# Altium schematic sheet schematic_sn74hc595n.SchDoc
size A3
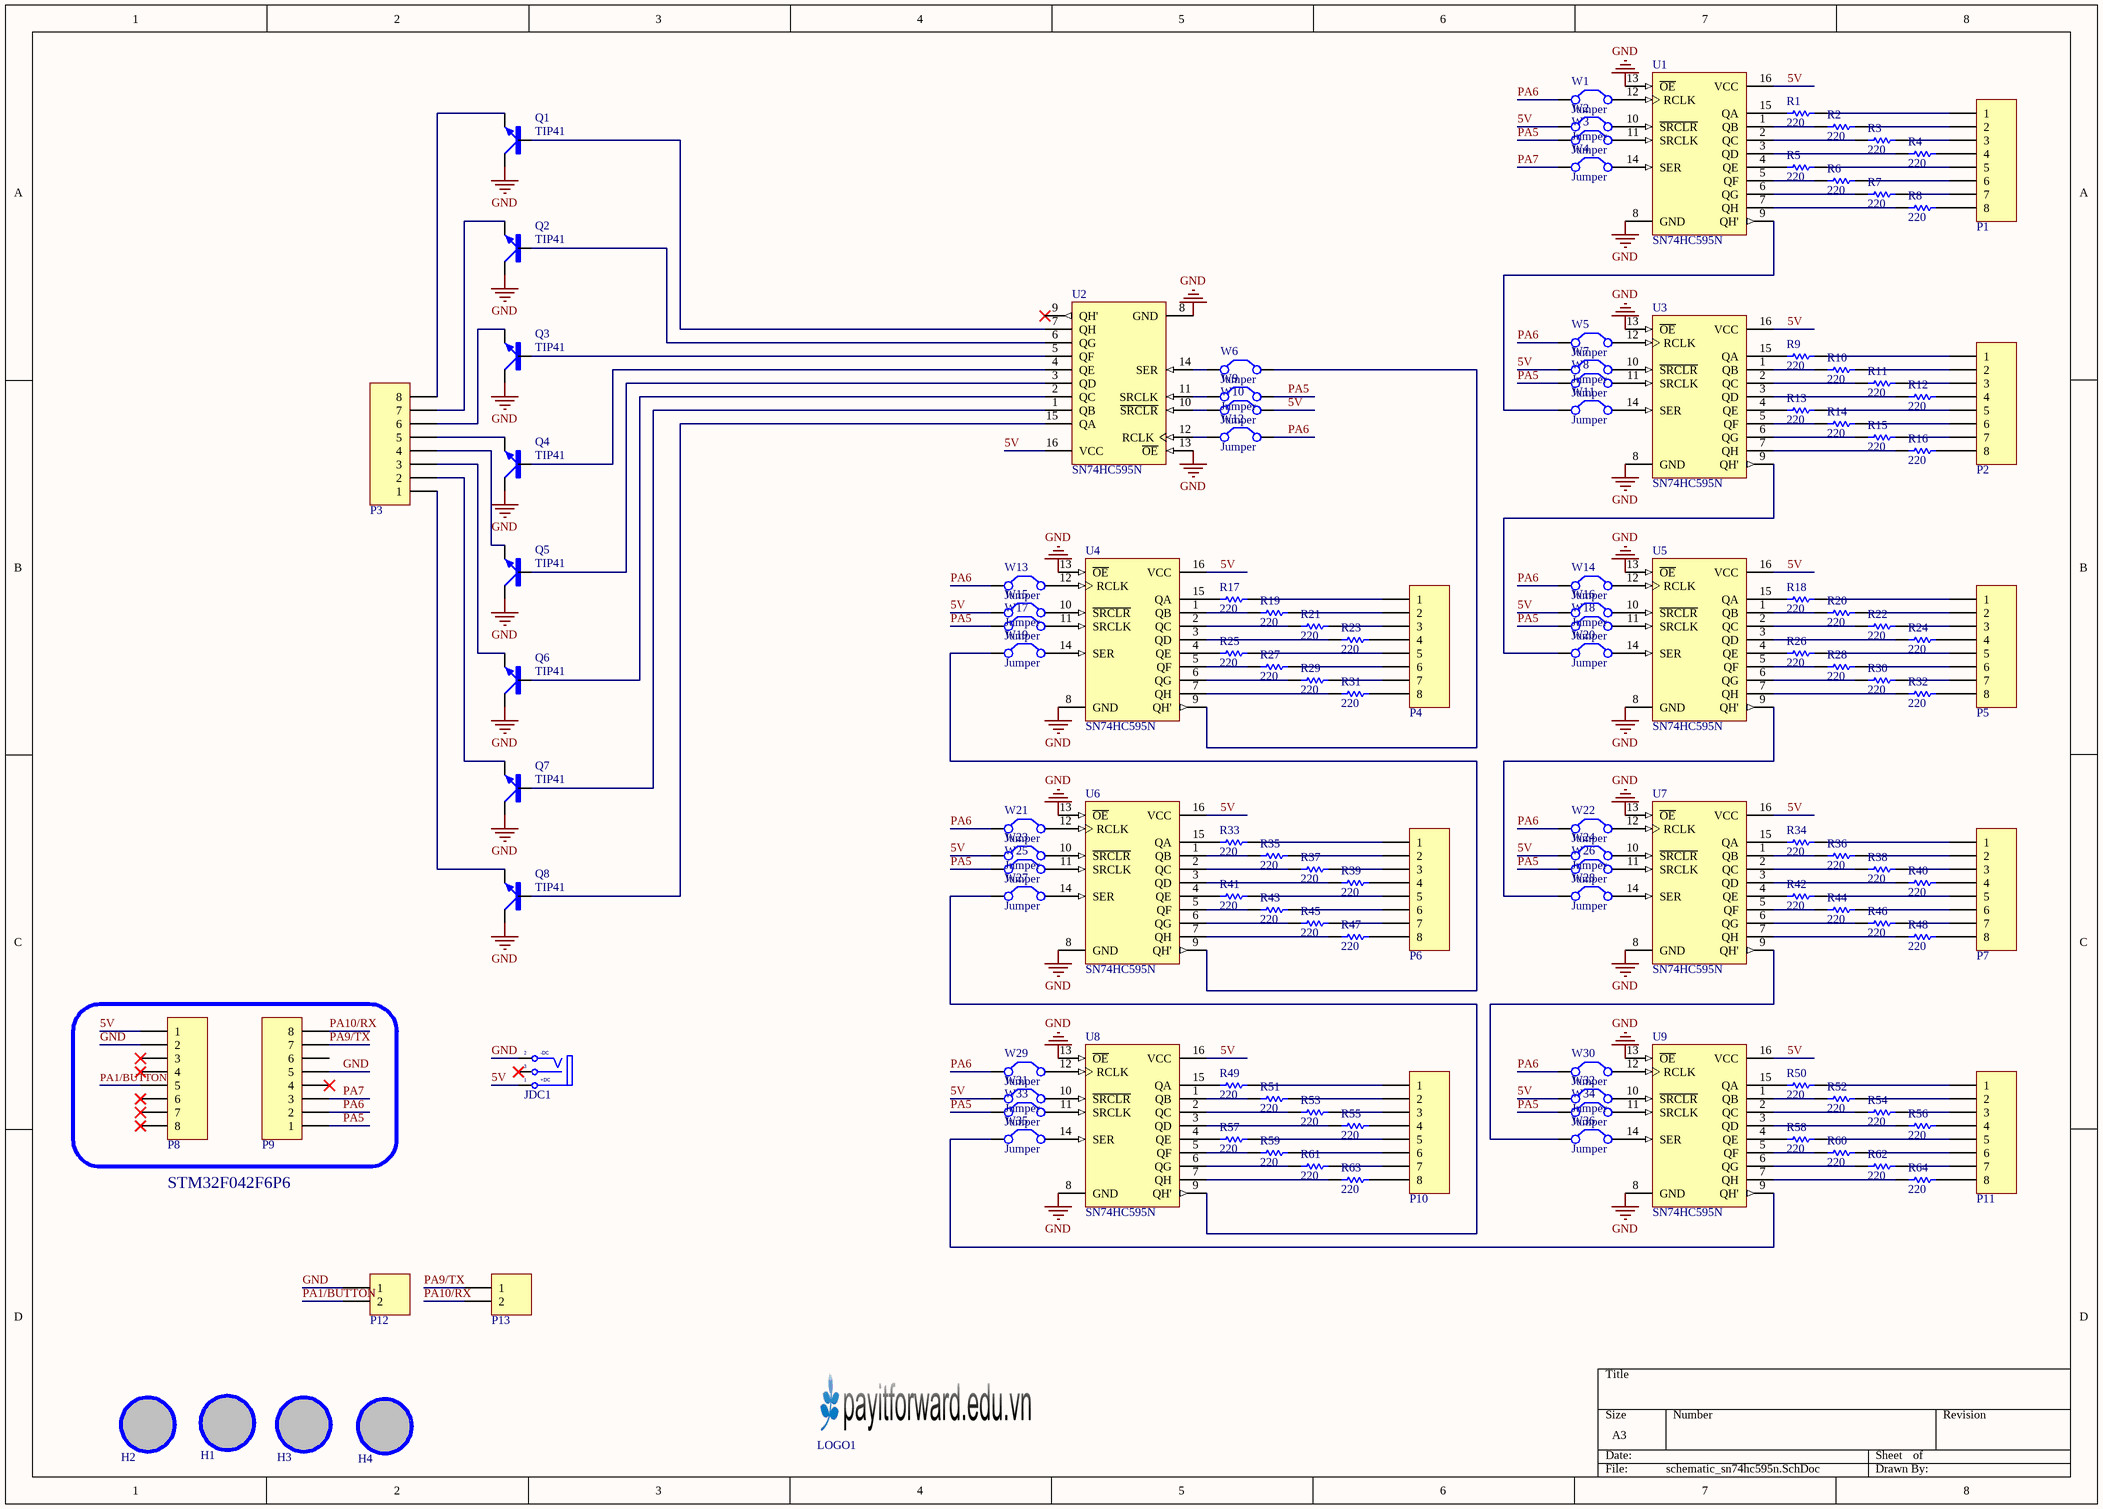
[diagram p0: schematic_sn74hc595n.SchDoc]

## Parts
H1  Hole  [LO KHOAN 3MM]  (value not drawn)
H2  Hole  [LO KHOAN 3MM]  (value not drawn)
H3  Hole  [LO KHOAN 3MM]  (value not drawn)
H4  Hole  [LO KHOAN 3MM]  (value not drawn)
JDC1  Jack DC  [DC-IN]  (value not drawn)
LOGO1  LOGO PIF  [PIF LOGO BIG SSTOP]  (value not drawn)
P1  Header 8  [JP8]  (value not drawn)
P2  Header 8  [JP8]  (value not drawn)
P3  Header 8  [JP8]  (value not drawn)
P4  Header 8  [JP8]  (value not drawn)
P5  Header 8  [JP8]  (value not drawn)
P6  Header 8  [JP8]  (value not drawn)
P7  Header 8  [JP8]  (value not drawn)
P8  Header 8  [JP8]  (value not drawn)
P9  Header 8  [JP8]  (value not drawn)
P10  Header 8  [JP8]  (value not drawn)
P11  Header 8  [JP8]  (value not drawn)
P12  Header 2  [JP2]  (value not drawn)
P13  Header 2  [JP2]  (value not drawn)
Q1  TIP41  [TRANSISTOR-TO220AV-BCE]
Q2  TIP41  [TRANSISTOR-TO220AV-BCE]
Q3  TIP41  [TRANSISTOR-TO220AV-BCE]
Q4  TIP41  [TRANSISTOR-TO220AV-BCE]
Q5  TIP41  [TRANSISTOR-TO220AV-BCE]
Q6  TIP41  [TRANSISTOR-TO220AV-BCE]
Q7  TIP41  [TRANSISTOR-TO220AV-BCE]
Q8  TIP41  [TRANSISTOR-TO220AV-BCE]
R1  value 220  [RES 1/2W]  (hidden comment: RESISTOR)
R2  value 220  [RES 1/2W]  (hidden comment: RESISTOR)
R3  value 220  [RES 1/2W]  (hidden comment: RESISTOR)
R4  value 220  [RES 1/2W]  (hidden comment: RESISTOR)
R5  value 220  [RES 1/2W]  (hidden comment: RESISTOR)
R6  value 220  [RES 1/2W]  (hidden comment: RESISTOR)
R7  value 220  [RES 1/2W]  (hidden comment: RESISTOR)
R8  value 220  [RES 1/2W]  (hidden comment: RESISTOR)
R9  value 220  [RES 1/2W]  (hidden comment: RESISTOR)
R10  value 220  [RES 1/2W]  (hidden comment: RESISTOR)
R11  value 220  [RES 1/2W]  (hidden comment: RESISTOR)
R12  value 220  [RES 1/2W]  (hidden comment: RESISTOR)
R13  value 220  [RES 1/2W]  (hidden comment: RESISTOR)
R14  value 220  [RES 1/2W]  (hidden comment: RESISTOR)
R15  value 220  [RES 1/2W]  (hidden comment: RESISTOR)
R16  value 220  [RES 1/2W]  (hidden comment: RESISTOR)
R17  value 220  [RES 1/2W]  (hidden comment: RESISTOR)
R18  value 220  [RES 1/2W]  (hidden comment: RESISTOR)
R19  value 220  [RES 1/2W]  (hidden comment: RESISTOR)
R20  value 220  [RES 1/2W]  (hidden comment: RESISTOR)
R21  value 220  [RES 1/2W]  (hidden comment: RESISTOR)
R22  value 220  [RES 1/2W]  (hidden comment: RESISTOR)
R23  value 220  [RES 1/2W]  (hidden comment: RESISTOR)
R24  value 220  [RES 1/2W]  (hidden comment: RESISTOR)
R25  value 220  [RES 1/2W]  (hidden comment: RESISTOR)
R26  value 220  [RES 1/2W]  (hidden comment: RESISTOR)
R27  value 220  [RES 1/2W]  (hidden comment: RESISTOR)
R28  value 220  [RES 1/2W]  (hidden comment: RESISTOR)
R29  value 220  [RES 1/2W]  (hidden comment: RESISTOR)
R30  value 220  [RES 1/2W]  (hidden comment: RESISTOR)
R31  value 220  [RES 1/2W]  (hidden comment: RESISTOR)
R32  value 220  [RES 1/2W]  (hidden comment: RESISTOR)
R33  value 220  [RES 1/2W]  (hidden comment: RESISTOR)
R34  value 220  [RES 1/2W]  (hidden comment: RESISTOR)
R35  value 220  [RES 1/2W]  (hidden comment: RESISTOR)
R36  value 220  [RES 1/2W]  (hidden comment: RESISTOR)
R37  value 220  [RES 1/2W]  (hidden comment: RESISTOR)
R38  value 220  [RES 1/2W]  (hidden comment: RESISTOR)
R39  value 220  [RES 1/2W]  (hidden comment: RESISTOR)
R40  value 220  [RES 1/2W]  (hidden comment: RESISTOR)
R41  value 220  [RES 1/2W]  (hidden comment: RESISTOR)
R42  value 220  [RES 1/2W]  (hidden comment: RESISTOR)
R43  value 220  [RES 1/2W]  (hidden comment: RESISTOR)
R44  value 220  [RES 1/2W]  (hidden comment: RESISTOR)
R45  value 220  [RES 1/2W]  (hidden comment: RESISTOR)
R46  value 220  [RES 1/2W]  (hidden comment: RESISTOR)
R47  value 220  [RES 1/2W]  (hidden comment: RESISTOR)
R48  value 220  [RES 1/2W]  (hidden comment: RESISTOR)
R49  value 220  [RES 1/2W]  (hidden comment: RESISTOR)
R50  value 220  [RES 1/2W]  (hidden comment: RESISTOR)
R51  value 220  [RES 1/2W]  (hidden comment: RESISTOR)
R52  value 220  [RES 1/2W]  (hidden comment: RESISTOR)
R53  value 220  [RES 1/2W]  (hidden comment: RESISTOR)
R54  value 220  [RES 1/2W]  (hidden comment: RESISTOR)
R55  value 220  [RES 1/2W]  (hidden comment: RESISTOR)
R56  value 220  [RES 1/2W]  (hidden comment: RESISTOR)
R57  value 220  [RES 1/2W]  (hidden comment: RESISTOR)
R58  value 220  [RES 1/2W]  (hidden comment: RESISTOR)
R59  value 220  [RES 1/2W]  (hidden comment: RESISTOR)
R60  value 220  [RES 1/2W]  (hidden comment: RESISTOR)
R61  value 220  [RES 1/2W]  (hidden comment: RESISTOR)
R62  value 220  [RES 1/2W]  (hidden comment: RESISTOR)
R63  value 220  [RES 1/2W]  (hidden comment: RESISTOR)
R64  value 220  [RES 1/2W]  (hidden comment: RESISTOR)
U1  SN74HC595N  [N016]
U2  SN74HC595N  [N016]
U3  SN74HC595N  [N016]
U4  SN74HC595N  [N016]
U5  SN74HC595N  [N016]
U6  SN74HC595N  [N016]
U7  SN74HC595N  [N016]
U8  SN74HC595N  [N016]
U9  SN74HC595N  [N016]
W1  Jumper  [RAD-0.2]
W2  Jumper  [RAD-0.2]
W3  Jumper  [RAD-0.2]
W4  Jumper  [RAD-0.2]
W5  Jumper  [RAD-0.2]
W6  Jumper  [RAD-0.2]
W7  Jumper  [RAD-0.2]
W8  Jumper  [RAD-0.2]
W9  Jumper  [RAD-0.2]
W10  Jumper  [RAD-0.2]
W11  Jumper  [RAD-0.2]
W12  Jumper  [RAD-0.2]
W13  Jumper  [RAD-0.2]
W14  Jumper  [RAD-0.2]
W15  Jumper  [RAD-0.2]
W16  Jumper  [RAD-0.2]
W17  Jumper  [RAD-0.2]
W18  Jumper  [RAD-0.2]
W19  Jumper  [RAD-0.2]
W20  Jumper  [RAD-0.2]
W21  Jumper  [RAD-0.2]
W22  Jumper  [RAD-0.2]
W23  Jumper  [RAD-0.2]
W24  Jumper  [RAD-0.2]
W25  Jumper  [RAD-0.2]
W26  Jumper  [RAD-0.2]
W27  Jumper  [RAD-0.2]
W28  Jumper  [RAD-0.2]
W29  Jumper  [RAD-0.2]
W30  Jumper  [RAD-0.2]
W31  Jumper  [RAD-0.2]
W32  Jumper  [RAD-0.2]
W33  Jumper  [RAD-0.2]
W34  Jumper  [RAD-0.2]
W35  Jumper  [RAD-0.2]
W36  Jumper  [RAD-0.2]

## Nets
GND: JDC1.2(TN) P8.2 P9.5 P12.1 Q1.C Q2.C Q3.C Q4.C Q5.C Q6.C Q7.C Q8.C U1.8(GND) U1.13(~{OE}) U2.8(GND) U2.13(~{OE}) U3.8(GND) U3.13(~{OE}) U4.8(GND) U4.13(~{OE}) U5.8(GND) U5.13(~{OE}) U6.8(GND) U6.13(~{OE}) U7.8(GND) U7.13(~{OE}) U8.8(GND) U8.13(~{OE}) U9.8(GND) U9.13(~{OE})
5V: JDC1.1(T) P8.1 U1.16(VCC) U2.16(VCC) U3.16(VCC) U4.16(VCC) U5.16(VCC) U6.16(VCC) U7.16(VCC) U8.16(VCC) U9.16(VCC) W2.1(C1) W7.1(C1) W10.2(C2) W15.1(C1) W16.1(C1) W23.1(C1) W24.1(C1) W31.1(C1) W32.1(C1)
PA1/BUTTON: P8.5 P12.2
PA5: P9.1 W3.1(C1) W8.1(C1) W9.2(C2) W17.1(C1) W18.1(C1) W25.1(C1) W26.1(C1) W33.1(C1) W34.1(C1)
PA6: P9.2 W1.1(C1) W5.1(C1) W12.2(C2) W13.1(C1) W14.1(C1) W21.1(C1) W22.1(C1) W29.1(C1) W30.1(C1)
PA7: P9.3 W4.1(C1)
PA9/TX: P9.7 P13.1
PA10/RX: P9.8 P13.2
NetP1_1: P1.1 R1.2
NetP1_2: P1.2 R2.2
NetP1_3: P1.3 R3.2
NetP1_4: P1.4 R4.2
NetP1_5: P1.5 R5.2
NetP1_6: P1.6 R6.2
NetP1_7: P1.7 R7.2
NetP1_8: P1.8 R8.2
NetP2_1: P2.1 R9.2
NetP2_2: P2.2 R10.2
NetP2_3: P2.3 R11.2
NetP2_4: P2.4 R12.2
NetP2_5: P2.5 R13.2
NetP2_6: P2.6 R14.2
NetP2_7: P2.7 R15.2
NetP2_8: P2.8 R16.2
NetP3_1: P3.1 Q8.E
NetP3_2: P3.2 Q7.E
NetP3_3: P3.3 Q6.E
NetP3_4: P3.4 Q5.E
NetP3_5: P3.5 Q4.E
NetP3_6: P3.6 Q3.E
NetP3_7: P3.7 Q2.E
NetP3_8: P3.8 Q1.E
NetP4_1: P4.1 R17.2
NetP4_2: P4.2 R19.2
NetP4_3: P4.3 R21.2
NetP4_4: P4.4 R23.2
NetP4_5: P4.5 R25.2
NetP4_6: P4.6 R27.2
NetP4_7: P4.7 R29.2
NetP4_8: P4.8 R31.2
NetP5_1: P5.1 R18.2
NetP5_2: P5.2 R20.2
NetP5_3: P5.3 R22.2
NetP5_4: P5.4 R24.2
NetP5_5: P5.5 R26.2
NetP5_6: P5.6 R28.2
NetP5_7: P5.7 R30.2
NetP5_8: P5.8 R32.2
NetP6_1: P6.1 R33.2
NetP6_2: P6.2 R35.2
NetP6_3: P6.3 R37.2
NetP6_4: P6.4 R39.2
NetP6_5: P6.5 R41.2
NetP6_6: P6.6 R43.2
NetP6_7: P6.7 R45.2
NetP6_8: P6.8 R47.2
NetP7_1: P7.1 R34.2
NetP7_2: P7.2 R36.2
NetP7_3: P7.3 R38.2
NetP7_4: P7.4 R40.2
NetP7_5: P7.5 R42.2
NetP7_6: P7.6 R44.2
NetP7_7: P7.7 R46.2
NetP7_8: P7.8 R48.2
NetP10_1: P10.1 R49.2
NetP10_2: P10.2 R51.2
NetP10_3: P10.3 R53.2
NetP10_4: P10.4 R55.2
NetP10_5: P10.5 R57.2
NetP10_6: P10.6 R59.2
NetP10_7: P10.7 R61.2
NetP10_8: P10.8 R63.2
NetP11_1: P11.1 R50.2
NetP11_2: P11.2 R52.2
NetP11_3: P11.3 R54.2
NetP11_4: P11.4 R56.2
NetP11_5: P11.5 R58.2
NetP11_6: P11.6 R60.2
NetP11_7: P11.7 R62.2
NetP11_8: P11.8 R64.2
NetQ1_B: Q1.B U2.7(QH)
NetQ2_B: Q2.B U2.6(QG)
NetQ3_B: Q3.B U2.5(QF)
NetQ4_B: Q4.B U2.4(QE)
NetQ5_B: Q5.B U2.3(QD)
NetQ6_B: Q6.B U2.2(QC)
NetQ7_B: Q7.B U2.1(QB)
NetQ8_B: Q8.B U2.15(QA)
NetR1_1: R1.1 U1.15(QA)
NetR2_1: R2.1 U1.1(QB)
NetR3_1: R3.1 U1.2(QC)
NetR4_1: R4.1 U1.3(QD)
NetR5_1: R5.1 U1.4(QE)
NetR6_1: R6.1 U1.5(QF)
NetR7_1: R7.1 U1.6(QG)
NetR8_1: R8.1 U1.7(QH)
NetR9_1: R9.1 U3.15(QA)
NetR10_1: R10.1 U3.1(QB)
NetR11_1: R11.1 U3.2(QC)
NetR12_1: R12.1 U3.3(QD)
NetR13_1: R13.1 U3.4(QE)
NetR14_1: R14.1 U3.5(QF)
NetR15_1: R15.1 U3.6(QG)
NetR16_1: R16.1 U3.7(QH)
NetR17_1: R17.1 U4.15(QA)
NetR18_1: R18.1 U5.15(QA)
NetR19_1: R19.1 U4.1(QB)
NetR20_1: R20.1 U5.1(QB)
NetR21_1: R21.1 U4.2(QC)
NetR22_1: R22.1 U5.2(QC)
NetR23_1: R23.1 U4.3(QD)
NetR24_1: R24.1 U5.3(QD)
NetR25_1: R25.1 U4.4(QE)
NetR26_1: R26.1 U5.4(QE)
NetR27_1: R27.1 U4.5(QF)
NetR28_1: R28.1 U5.5(QF)
NetR29_1: R29.1 U4.6(QG)
NetR30_1: R30.1 U5.6(QG)
NetR31_1: R31.1 U4.7(QH)
NetR32_1: R32.1 U5.7(QH)
NetR33_1: R33.1 U6.15(QA)
NetR34_1: R34.1 U7.15(QA)
NetR35_1: R35.1 U6.1(QB)
NetR36_1: R36.1 U7.1(QB)
NetR37_1: R37.1 U6.2(QC)
NetR38_1: R38.1 U7.2(QC)
NetR39_1: R39.1 U6.3(QD)
NetR40_1: R40.1 U7.3(QD)
NetR41_1: R41.1 U6.4(QE)
NetR42_1: R42.1 U7.4(QE)
NetR43_1: R43.1 U6.5(QF)
NetR44_1: R44.1 U7.5(QF)
NetR45_1: R45.1 U6.6(QG)
NetR46_1: R46.1 U7.6(QG)
NetR47_1: R47.1 U6.7(QH)
NetR48_1: R48.1 U7.7(QH)
NetR49_1: R49.1 U8.15(QA)
NetR50_1: R50.1 U9.15(QA)
NetR51_1: R51.1 U8.1(QB)
NetR52_1: R52.1 U9.1(QB)
NetR53_1: R53.1 U8.2(QC)
NetR54_1: R54.1 U9.2(QC)
NetR55_1: R55.1 U8.3(QD)
NetR56_1: R56.1 U9.3(QD)
NetR57_1: R57.1 U8.4(QE)
NetR58_1: R58.1 U9.4(QE)
NetR59_1: R59.1 U8.5(QF)
NetR60_1: R60.1 U9.5(QF)
NetR61_1: R61.1 U8.6(QG)
NetR62_1: R62.1 U9.6(QG)
NetR63_1: R63.1 U8.7(QH)
NetR64_1: R64.1 U9.7(QH)
NetU1_9: U1.9(QH') W11.1(C1)
NetU1_10: U1.10(~{SRCLR}) W2.2(C2)
NetU1_11: U1.11(SRCLK) W3.2(C2)
NetU1_12: U1.12(RCLK) W1.2(C2)
NetU1_14: U1.14(SER) W4.2(C2)
NetU2_10: U2.10(~{SRCLR}) W10.1(C1)
NetU2_11: U2.11(SRCLK) W9.1(C1)
NetU2_12: U2.12(RCLK) W12.1(C1)
NetU2_14: U2.14(SER) W6.1(C1)
NetU3_9: U3.9(QH') W20.1(C1)
NetU3_10: U3.10(~{SRCLR}) W7.2(C2)
NetU3_11: U3.11(SRCLK) W8.2(C2)
NetU3_12: U3.12(RCLK) W5.2(C2)
NetU3_14: U3.14(SER) W11.2(C2)
NetU4_9: U4.9(QH') W6.2(C2)
NetU4_10: U4.10(~{SRCLR}) W15.2(C2)
NetU4_11: U4.11(SRCLK) W17.2(C2)
NetU4_12: U4.12(RCLK) W13.2(C2)
NetU4_14: U4.14(SER) W19.2(C2)
NetU5_9: U5.9(QH') W28.1(C1)
NetU5_10: U5.10(~{SRCLR}) W16.2(C2)
NetU5_11: U5.11(SRCLK) W18.2(C2)
NetU5_12: U5.12(RCLK) W14.2(C2)
NetU5_14: U5.14(SER) W20.2(C2)
NetU6_9: U6.9(QH') W19.1(C1)
NetU6_10: U6.10(~{SRCLR}) W23.2(C2)
NetU6_11: U6.11(SRCLK) W25.2(C2)
NetU6_12: U6.12(RCLK) W21.2(C2)
NetU6_14: U6.14(SER) W27.2(C2)
NetU7_9: U7.9(QH') W36.1(C1)
NetU7_10: U7.10(~{SRCLR}) W24.2(C2)
NetU7_11: U7.11(SRCLK) W26.2(C2)
NetU7_12: U7.12(RCLK) W22.2(C2)
NetU7_14: U7.14(SER) W28.2(C2)
NetU8_9: U8.9(QH') W27.1(C1)
NetU8_10: U8.10(~{SRCLR}) W31.2(C2)
NetU8_11: U8.11(SRCLK) W33.2(C2)
NetU8_12: U8.12(RCLK) W29.2(C2)
NetU8_14: U8.14(SER) W35.2(C2)
NetU9_9: U9.9(QH') W35.1(C1)
NetU9_10: U9.10(~{SRCLR}) W32.2(C2)
NetU9_11: U9.11(SRCLK) W34.2(C2)
NetU9_12: U9.12(RCLK) W30.2(C2)
NetU9_14: U9.14(SER) W36.2(C2)

Not connected (* = marked no-connect by the designer): H1 1; H2 1; H3 1; H4 1; JDC1 3(S)*; P8 3* 4* 6* 7* 8*; P9 4* 6; U2 9(QH')*

## Notes on the sheet
- STM32F042F6P6
- (in symbol Jack DC) -DC; +DC

## Library data of the parts
H1-H4 = Hole: Hole 3mm
JDC1 = Jack DC: Jack DC input; Value: Jac DC
P1-P11 = Header 8: Header, 8-Pin; LatestRevisionDate: 17-Jul-2002; LatestRevisionNote: Re-released for DXP Platform.; Publisher: Altium Limited
P12 P13 = Header 2: Header, 2-Pin; LatestRevisionDate: 17-Jul-2002; LatestRevisionNote: Re-released for DXP Platform.; Publisher: Altium Limited
Q1-Q8 = TIP41: Bipolar Transistors - BJT 6A 40V 65W NPN; MF: ON Semiconductor; Package: None; Value: *; MP: TIP41; SnapEDA_Link: https://www.snapeda.com/parts/TIP41/ON%20Semiconductor/view-part/4725228/?ref=snap; Availability: Unavailable; Price: None
U1-U9 = SN74HC595N: 8-Bit Shift Register with 3-State Output Registers; Published: 8-Jun-2000; LatestRevisionDate: 04-Mar-2005; LatestRevisionNote: Stylized 3D Model Added.; DatasheetVersion: May-1997; PackageVersion: Oct-1995; PackageReference: N016; Publisher: Altium Limited; PackageDescription: DIP; 16 Leads; Row Spacing 7.62 mm; Pitch 2.54 mm; Code_JEDEC: MS-001-BB; ComponentLink1Description: Manufacturer Link; ComponentLink1URL: http://www.ti.com/; ComponentLink2Description: Datasheet; ComponentLink2URL: http://www-s.ti.com/sc/ds/sn74hc595.pdf
W1-W36 = Jumper: Jumper Wire; Published: 24-Mar-1999; LatestRevisionDate: 17-Jul-2002; LatestRevisionNote: Re-released for DXP Platform.; PackageReference: RAD-0.2; Publisher: Altium Limited; PackageDescription: Radial Cap, Thru-Hole; 2 Leads; 0.2 in Pin Spacing